# Altium schematic sheet Main.SchDoc: Lighting Syatem
size A4; DrawnBy: Saliya Dinusha; DocumentNumber: 1; Revision: 1; SheetNumber: 1; SheetTotal: 1
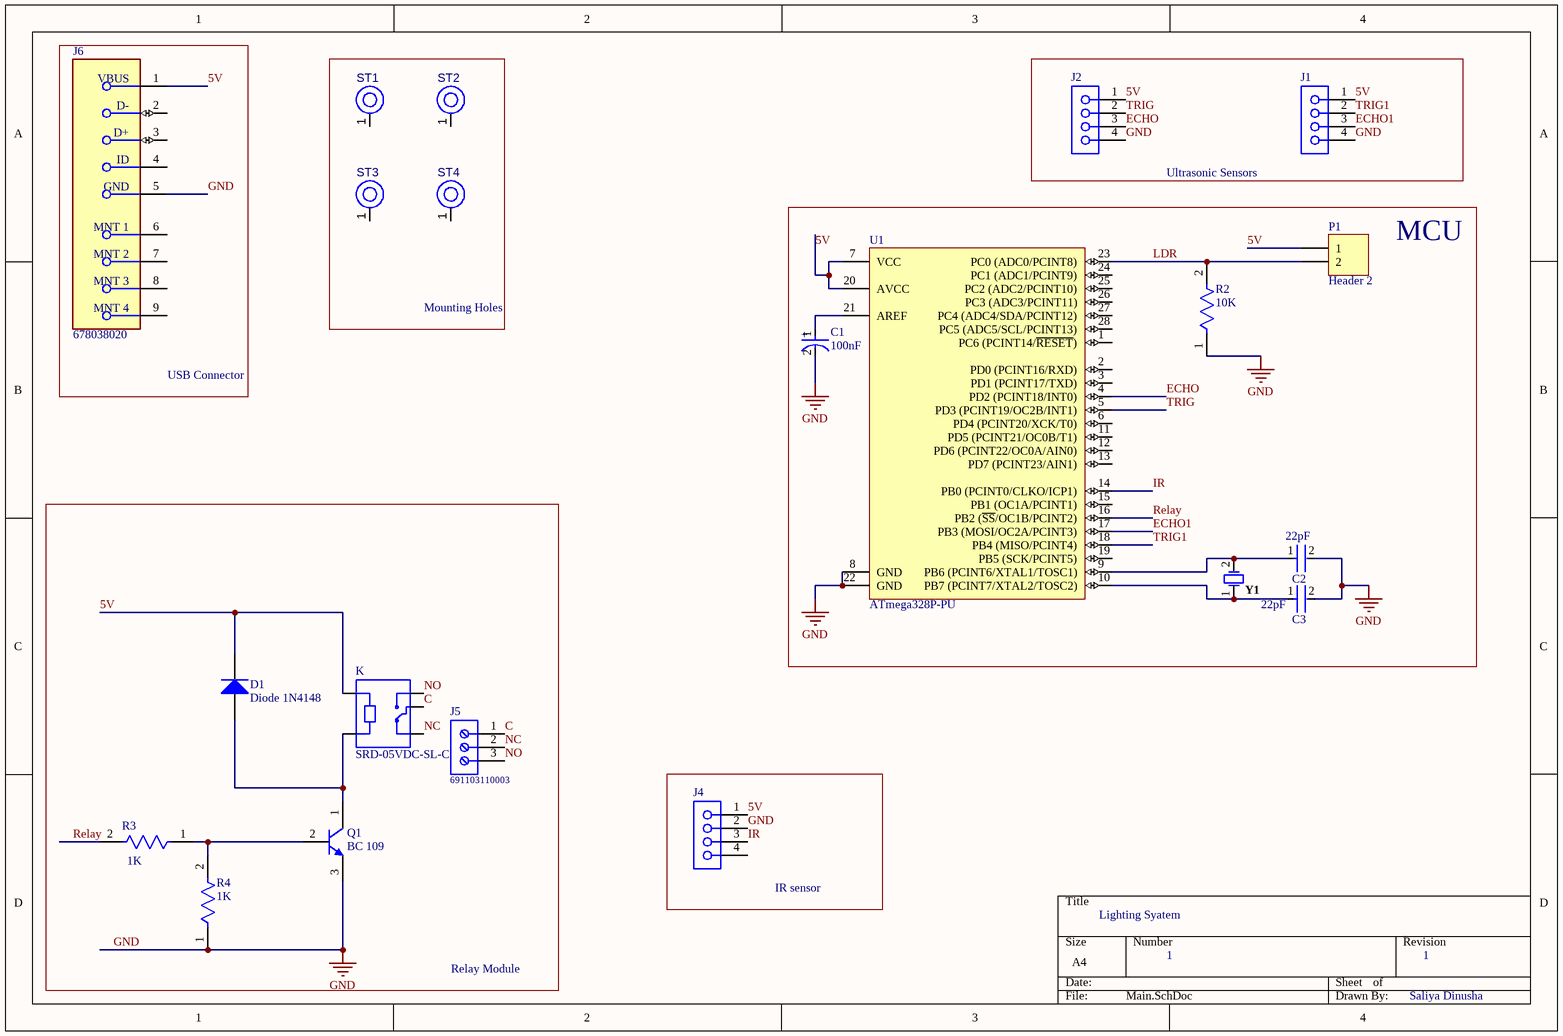
[diagram p0: Main.SchDoc]

## Parts
C1  100nF  [FP-EEU-FC1V221L-MFG]
C2  22pF  [FP-RDE0M1-MFG]
C3  22pF  [FP-RDE0M1-MFG]
D1  Diode 1N4148  [DO-35]
J1  SLW-104-01-T-S  [SMTC-SLW-104-01-X-S]  (value not drawn)
J2  SLW-104-01-T-S  [SMTC-SLW-104-01-X-S]  (value not drawn)
J4  SLW-104-01-T-S  [SMTC-SLW-104-01-X-S]  (value not drawn)
J5  691103110003  [691103110003]
J6  678038020  [FP-678038020-MFG]
K  SRD-05VDC-SL-C  [RELAY_SRD-05VDC-SL-C]
P1  Header 2  [HDR1X2]
Q1  BC 109  [ONSC-TO-92-3-29-11]
R2  10K  [FP-CF14-MFG]
R3  1K  [FP-CF14-MFG]
R4  1K  [FP-CF14-MFG]
ST1  PTH-M2D5X5  [PTH-M2D5X5]  (value not drawn)  (no BOM)
ST2  PTH-M2D5X5  [PTH-M2D5X5]  (value not drawn)  (no BOM)
ST3  PTH-M2D5X5  [PTH-M2D5X5]  (value not drawn)  (no BOM)
ST4  PTH-M2D5X5  [PTH-M2D5X5]  (value not drawn)  (no BOM)
U1  ATmega328P-PU  [28P3]
Y1  FOXSLF/120-20  [FOX-FOXSLF-2_V]  (value not drawn)

## Blocks framed on the sheet
USB Connector: J6
Mounting Holes: ST1-ST4
Ultrasonic Sensors: J1 J2
MCU: C1-C3 P1 R2 U1 Y1
Relay Module: D1 J5 K Q1 R3 R4
IR sensor: J4

## Nets
GND: C1.2(A) C2.2 C3.2 J1.4 J2.4 J4.2 J6.5(GND) Q1.3(E) R2.1 R4.1 U1.8(GND) U1.22(GND)
5V: D1.2(K) J1.1 J2.1 J4.1 J6.1(VBUS) K.A1 P1.1 U1.7(VCC) U1.20(AVCC)  [also labelled \]
C: J5.1 K.COM
ECHO: J2.3 U1.4(PD2_(PCINT18/INT0))
ECHO1: J1.3 U1.17(PB3_(MOSI/OC2A/PCINT3))
IR: J4.3 U1.14(PB0_(PCINT0/CLKO/ICP1))
LDR: P1.2 R2.2 U1.23(PC0_(ADC0/PCINT8))
NC: J5.2 K.NC
NO: J5.3 K.NO
Relay: R3.2 U1.16(PB2_(~{SS}/OC1B/PCINT2))
TRIG: J2.2 U1.5(PD3_(PCINT19/OC2B/INT1))
TRIG1: J1.2 U1.18(PB4_(MISO/PCINT4))
NetC1_1: C1.1(C) U1.21(AREF)
NetC2_1: C2.1 U1.9(PB6_(PCINT6/XTAL1/TOSC1)) Y1.2
NetC3_1: C3.1 U1.10(PB7_(PCINT7/XTAL2/TOSC2)) Y1.1
NetD1_1: D1.1(A) K.A2 Q1.1(C)
NetQ1_2: Q1.2(B) R3.1 R4.2

Not connected (* = marked no-connect by the designer): J4 4; J6 2(D-) 3(D+) 4(ID) 6(MNT_1) 7(MNT_2) 8(MNT_3) 9(MNT_4); ST1 1(H1); ST2 1(H1); ST3 1(H1); ST4 1(H1); U1 1(PC6_(PCINT14/~{RESET})) 2(PD0_(PCINT16/RXD)) 3(PD1_(PCINT17/TXD)) 6(PD4_(PCINT20/XCK/T0)) 11(PD5_(PCINT21/OC0B/T1)) 12(PD6_(PCINT22/OC0A/AIN0)) 13(PD7_(PCINT23/AIN1)) 15(PB1_(OC1A/PCINT1)) 19(PB5_(SCK/PCINT5)) 24(PC1_(ADC1/PCINT9)) 25(PC2_(ADC2/PCINT10)) 26(PC3_(ADC3/PCINT11)) 27(PC4_(ADC4/SDA/PCINT12)) 28(PC5_(ADC5/SCL/PCINT13))

## Notes on the sheet
- (in symbol CMP-05427-000010-1) +

## Library data of the parts
C1 = CMP-05427-000010-1: CAP ALUM 220UF 20% 35V RADIAL; Manufacturer: Panasonic Electronic Components; Manufacturer Part Number: EEU-FC1V221L; Material: Aluminum; Leakage Current: 77uA; Esr: 0.085Ω; Life: 2000Hours; Automotive Grade: Grade 2; Dissipation Factor: 12%; Ripple Current: 730mA; Octopart: https://octopart.com/eeu-fc1v221l-panasonic-39478519; ComponentLink2URL: https://industrial.panasonic.com/cdbs/www-data/pdf/RDF0000/ABA0000C1209.pdf; Package: 0; Height: 16.5mm; Category: Cap; Value: 100nF; ComponentLink2Description: Datasheet; Lead Free: Yes; Device Class L2: Capacitors; Temperature Range High: +105°C; Mouser Description: Capacitor; Aluminum Electrolytic; Fc Radial Elec Cap 220uF 35V; Temperature: -55°C to +105°C; Digikey Description: CAP ALUM 220UF 20% 35V RADIAL; Device Class L3: Aluminum Electrolytic Capacitors; Device Class L1: Passive Components; Automotive: Yes; RoHS: TRUE; Temperature Range Low: -55°C; Capacitance: 100nF; Voltage Rating: 35V; Tolerance: 20%
C2 C3 = CMP-06035-051680-1: Ceramic Capacitor 100nF ±10% 50V X7R Radial; Lead/Base Style: Kinked; Lead Diameter: 0.5mm; Lead Free: Lead Free; Mount: Through Hole; Package Quantity: 2000; Lead Pitch: 0.197inch; Capacitance: 22pF; Case/Package: Radial; Tolerance: 10%; Height - Seated (Max): 0.236inch; Max Operating Temperature: 125°C; Dielectric: X7R; Min Operating Temperature: -55°C; Voltage Rating (DC): 50V; Voltage Rating: 50V; Termination: Radial; Height: 3.5mm; Resistor Type: Ceramic; Width: 3.5mm; Packaging: Tape and Reel; Length: 0.157inch
D1 = Diode 1N4148: High Conductance Fast Diode; Published: 8-Jun-2000; LatestRevisionDate: 17-Jul-2002; LatestRevisionNote: Re-released for DXP Platform.; DatasheetVersion: 1997; PackageReference: DO-35; Publisher: Altium Limited; PackageDescription: Diode, Axial; Body 3.8 x 1.9 mm (LxDia. max), Lead Dia. 0.53 mm (max); Code_JEDEC: DO-204-AH; ComponentLink1Description: Manufacturer Link; ComponentLink1URL: http://www.fairchildsemi.com/; ComponentLink2Description: Datasheet; ComponentLink2URL: http://www.fairchildsemi.com/ds/1N%2F1N4148.pdf
J1 J2 J4 = CMP-1023-00131-1: Low Profile Socket Strips, Through-hole, Vertical, -55 to 105 degC, 2.54 mm Pitch, 4-Pin, Female, RoHS; Manufacturer: Samtec; Pitch: 2.54 mm; ComponentLink2Description: Datasheet; Temperature Range: -55 to 105 degC; RoHS: True; PackageDescription: Low Profile Socket Strip; PackageVersion: X, 9/1987; Orientation: Vertical; ComponentLink2URL: http://www.samtec.com/documents/webfiles/pdf/SLW.PDF; ComponentLink1URL: http://www.samtec.com; ComponentLink3URL: http://www.samtec.com/documents/webfiles/cpdf/SLW-1XX-01-X-X-MKT.pdf; PackageReference: SLW-104-01-X-S; ComponentLink1Description: Manufacturer URL; DatasheetVersion: F-214; ComponentLink3Description: Package Specification; Mounting Technology: Through-hole; PartNumber: SLW-104-01-T-S
J5 = CMP-1502-03255-1: Series 1031 - 3.50 mm Horizontal Entry Modular with Pressure Clamp WR-TBL, 3 pin; Manufacturer: Wurth Elektronik; Pin Number: 3; Pitch: 3.50mm; Packaging: Box; Package Reference: 691103110003; Datasheet URL: http://katalog.we-online.de/em/datasheet/6911031100xx.pdf; Operating Temperature: -40to105degC; Manufacturer URL: http://www.we-online.de; Part Number: 691103110003; Publisher: WurthElektronik; Mounting Technology: THT
J6 = CMP-04767-000002-1: CONN RCPT USB2.0 MINI AB SMD R/A; Manufacturer: Molex; Is Female: yes; Pitch: 0.8mm; Number Of Contacts: 5; Conn Orientation: Right Angle; Voltage Rating: 30V; Shielding: true; Current Rating: 1A; Octopart: https://octopart.com/67803-8020-molex-7136109; ComponentLink2Description: Datasheet; Lead Free: Yes; Temperature Range Low: 0°C; Manufacturer Part Number: 678038020; Temperature: 0°C to +50°C; Usb Standard: USB 2.0; Device Class L2: USB Connectors; Device Class L3: unset; Category: Conn; Temperature Range High: +50°C; Mouser Description: Conn Mini-USB Type AB RCP 5 POS 0.8mm Solder RA SMD 5 Terminal 1 Port Embossed T/R; Device Class L1: Connectors; Ambient Temperature Range Low: 0°C; Contact Material: Gold,Nickel; Ambient Temperature Range High: +50°C; Height: 4.1mm; Package: 0; RoHS: TRUE; Digikey Description: CONN RCPT USB2.0 MINI AB SMD R/A; Automotive: No; Footprint Url: https://www.molex.com/pdm_docs/sd/678038020_sd.pdf; ComponentLink2URL: https://www.molex.com/webdocs/datasheets/pdf/en-us/0678038020_IO_CONNECTORS.pdf
K = SRD-05VDC-SL-C: 5V Trigger Relay Module For Arduino And Raspberry Pi 5V Trigger Relay Module For Arduino And Raspberry Pi; MF: Songle Relay; Package: None; Availability: Unavailable; Value: *; MP: SRD-05VDC-SL-C; SnapEDA_Link: https://www.snapeda.com/parts/SRD-05VDC-SL-C/Songle%20Relay/view-part/1029484/?ref=snap; Price: None
P1 = Header 2: Header, 2-Pin; LatestRevisionDate: 17-Jul-2002; LatestRevisionNote: Re-released for DXP Platform.; Publisher: Altium Limited
Q1 = CMP-1048-01461-1: Low Noise Transistor, NPN Silicon, 3-Pin TO-92, Pb-Free, Bulk Box; Manufacturer: On Semiconductor; IC Continuous (A): 0.1; ComponentLink1URL: http://www.onsemi.com/; DatasheetVersion: Rev. 2; ComponentLink1Description: Manufacturer URL; Mounting Technology: Through Hole; PackageVersion: Rev. AM; PackageReference: TO-92-3-29-11_AM_SL; PackageDescription: 3-Pin Transistor Outline, Body 4.825 x 3.685 mm, Pitch 1.27 mm; PartNumber: BC 109; ComponentLink2Description: Datasheet; ComponentLink3Description: Package Specification; ComponentLink3URL: http://www.onsemi.cn/pub_link/Collateral/2N6426-D.PDF; RoHS: TRUE; Packing: Bulk Box; ComponentLink2URL: http://www.onsemi.com/pub_link/Collateral/BC550C-D.PDF; Polarity: NPN
R2-R4 = CMP-26528-000003-1: RES 7.5K OHM 1/4W 5% AXIAL; Max Power Dissipation: 250mW; Temperature Coefficient: -400ppm/°C; RoHS Compliant: Yes; Lead Free: Lead Free; Max Operating Temperature: 155°C; Case/Package: Axial; Tolerance: 5%; Power Rating: 250mW; Diameter: 2.3mm; Features: Flame Retardant Coating; Series: CF; Resistor Type: Carbon Film; Number of Terminations: 2; Length: 0.256inch; Min Operating Temperature: -55°C; Contact Plating: Tin; Packaging: Tape and Reel; Mount: Through Hole; Radiation Hardening: No
  R2: Resistance: 10K
  R3 R4: Resistance: 1K
ST1-ST4 = CMP-00028-00004-1: M2 PTH (2.5mm), 5mm pad; Pins: 1
U1 = CMP-0095-00013-2: 8-bit AVR Microcontroller, 32KB Flash, 1KB EEPROM, 2KB SRAM, 28-pin PDIP, Industrial Grade (-40°C to 85°C); RevisionNote: DatasheetVersion updated. URLs added.; PackageVersion: revB, Sep-2001; PackageDescription: 28-lead (0.300"/7.62mm Wide) Plastic Dual Inline Package (PDIP); DatasheetVersion: revD, May-2011; ComponentLink1Description: Manufacturer URL; ComponentLink1URL: http://www.atmel.com/; PackageReference: 28P3; ComponentLink2Description: ATmega48A/48PA/88A/88PA/168A/168PA/328/328P Datasheet; ComponentLink3URL: http://www.atmel.com/dyn/resources/prod_documents/8271S.pdf; ComponentLink2URL: http://www.atmel.com/dyn/resources/prod_documents/8271.pdf; ComponentLink3Description: ATmega48A/48PA/88A/88PA/168A/168PA/328/328P Summary
Y1 = CMP-1749-00004-1: Resistance Weld Thru-Hole Crystal, 12 MHz, +/-30 ppm, -20 to 70 degC, 2-Pin THD, RoHS, Bulk; Elements: 1; Rds On Max: 115 mohm; Typical Rise Time: 90 ns; Max Power Dissipation: 2.5 W; Case\Package: TO-251-3; Input Capacitance: 350 pF; REACH SVHC: No SVHC; Length: 6.6 mm; ComponentLink1URL: http://www.foxonline.com/; PackageDescription: 2-Pin Through Hole Device, Body 11.35 x 4.65 mm, Pitch 4.88 mm; Radiation Hardening: No; Package Quantity: 70; Packaging: Rail/Tube; ComponentLink1Description: Manufacturer URL; Min Operating Temperature: -55 degC; Max Operating Temperature: 150 degC; RoHSCompliant: true; PackageReference: FOXSLF-2; DatasheetVersion: Mar-15; Pins: 3; Height: 6.1 mm; Mount: Through Hole; ComponentLink2URL: http://www.foxonline.com/pdfs/hc49slf.pdf; ComponentLink2Description: Datasheet; Width: 2.3 mm